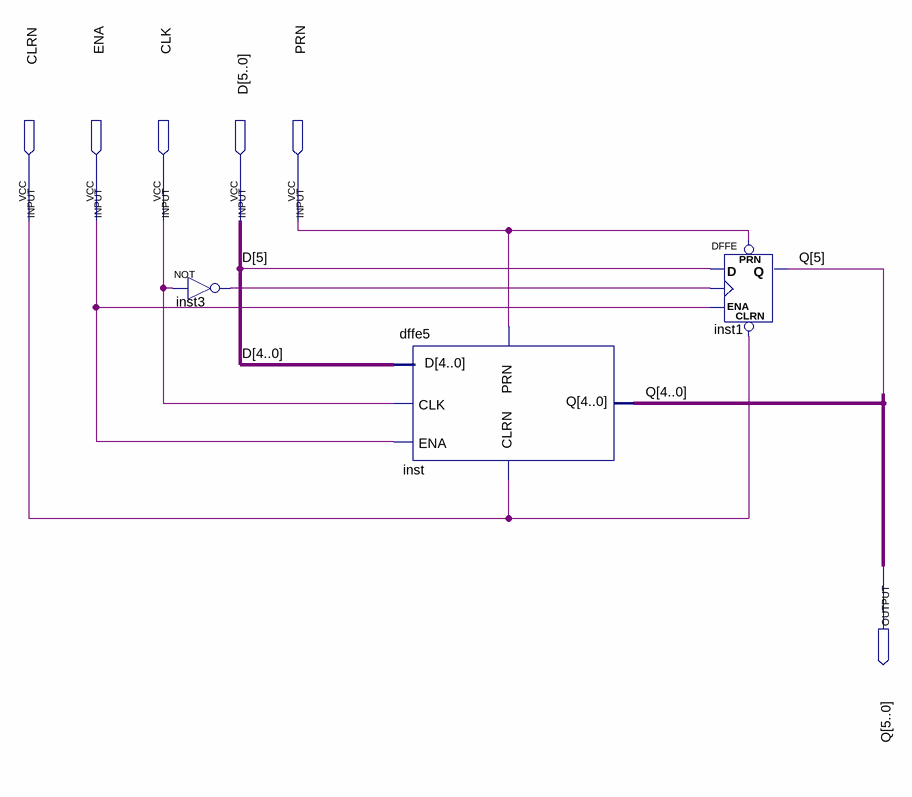
[diagram p0: schematic sheet]
// Quartus schematic dffe6.bdf as structural Verilog: 3 symbols, 6 pins
module dffe6 (
  input  CLRN,
  input  ENA,
  input  CLK,
  input  [5:0] D,
  input  PRN,
  output [5:0] Q
);

  wire inst3_out;

  not inst3 (inst3_out, CLK);
  dffe5 inst (.D(D[4:0]), .PRN(PRN), .CLK(CLK), .ENA(ENA), .CLRN(CLRN), .Q(Q[4:0]));
  DFFE inst1 (.PRN(PRN), .CLRN(CLRN), .D(D[5]), .CLK(inst3_out), .ENA(ENA), .Q(Q[5]));
endmodule
